# EAGLE schematic motor_driver (EAGLE 9.1.3)
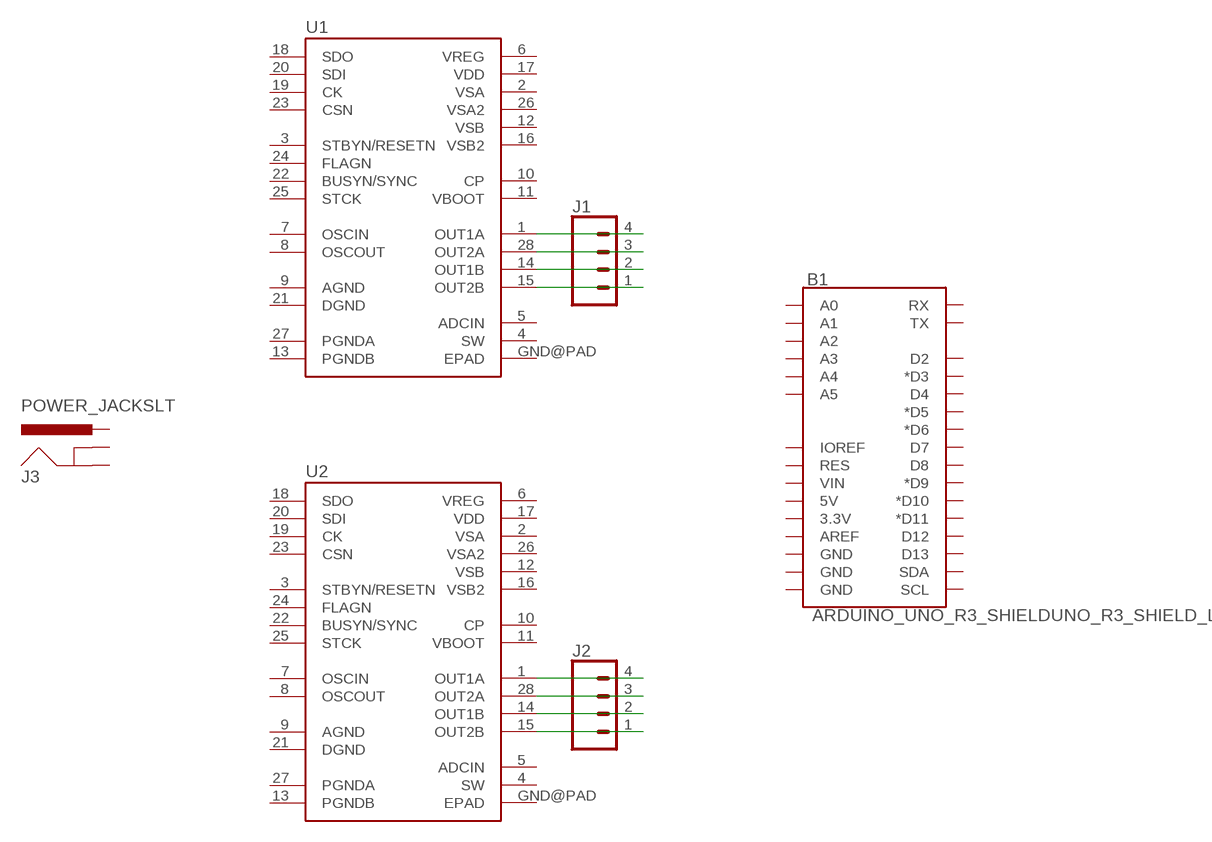
[diagram p0: schematic, sheet 1]

## Parts
B1  ARDUINO_UNO_R3_SHIELDUNO_R3_SHIELD_LOCK  [UNO_R3_SHIELD_LOCK]
J1  CONN_04SCREW  [SCREWTERMINAL-3.5MM-4]
J2  CONN_04SCREW  [SCREWTERMINAL-3.5MM-4]
J3  POWER_JACKSLT  [POWER_JACK_SLOT]
U1  L6470  [HTSSOP28]
U2  L6470  [HTSSOP28]

## Nets
N$1: J2.1 U2.15(OUT2B)
N$2: J2.2 U2.14(OUT1B)
N$3: J2.3 U2.28(OUT2A)
N$4: J2.4 U2.1(OUT1A)
N$5: J1.1 U1.15(OUT2B)
N$6: J1.2 U1.14(OUT1B)
N$7: J1.3 U1.28(OUT2A)
N$8: J1.4 U1.1(OUT1A)
Unconnected: B1.3.3V B1.5V B1.A0 B1.A1 B1.A2 B1.A3 B1.A4 B1.A5 B1.AREF B1.D2 B1.D3(*D3) B1.D4 B1.D5(*D5) B1.D6(*D6) B1.D7 B1.D8 B1.D9(*D9) B1.D10(*D10) B1.D11(*D11) B1.D12 B1.D13 B1.GND@0(GND) B1.GND@1(GND) B1.GND@2(GND) B1.IOREF B1.RES B1.RX B1.SCL B1.SDA B1.TX B1.VIN J3.GND@1(GNDBREAK) J3.GND@2(GND) J3.PWR U1.2(VSA) U1.3(STBYN/RESETN) U1.4(SW) U1.5(ADCIN) U1.6(VREG) U1.7(OSCIN) U1.8(OSCOUT) U1.9(AGND) U1.10(CP) U1.11(VBOOT) U1.12(VSB) U1.13(PGNDB) U1.16(VSB2) U1.17(VDD) U1.18(SDO) U1.19(CK) U1.20(SDI) U1.21(DGND) U1.22(BUSYN/SYNC) U1.23(CSN) U1.24(FLAGN) U1.25(STCK) U1.26(VSA2) U1.27(PGNDA) U1.GND@PAD(EPAD) U2.2(VSA) U2.3(STBYN/RESETN) U2.4(SW) U2.5(ADCIN) U2.6(VREG) U2.7(OSCIN) U2.8(OSCOUT) U2.9(AGND) U2.10(CP) U2.11(VBOOT) U2.12(VSB) U2.13(PGNDB) U2.16(VSB2) U2.17(VDD) U2.18(SDO) U2.19(CK) U2.20(SDI) U2.21(DGND) U2.22(BUSYN/SYNC) U2.23(CSN) U2.24(FLAGN) U2.25(STCK) U2.26(VSA2) U2.27(PGNDA) U2.GND@PAD(EPAD)

## Library data of the parts
B1 = SparkFun-Boards:ARDUINO_UNO_R3_SHIELD: Arduino R3 Shield Footprint Shield form compatible with the Arduino Uno R3. SparkFun Products: MG2639 Cellular Shield <https://www.sparkfun.com/products/13120> MIDI Shield <https://www.sparkfun.com/products/12898> R3 Stackable Headers Kit <https://www.sparkfun.com/products/11417>
J1 J2 = SparkFun-Connectors:CONN_04: Multi connection point. Often used as Generic Header-pin footprint for 0.1 inch spaced/style header connections On any of the 0.1 inch spaced packages, you can populate with these: Break Away Headers - Straight <https://www.sparkfun.com/products/116> (PRT-00116) Break Away Male Headers - Right Angle <https://www.sparkfun.com/products/553> (PRT-00553) Female Headers <https://www.sparkfun.com/products/115> (PRT-00115) Break Away Headers - Machine Pin <https://www.sparkfun.com/products/117> (PRT-00117) Break Away Female Headers - Swiss Machine Pin <https://www.sparkfun.com/products/743> (PRT-00743) For SCREWTERMINALS and SPRING TERMINALS visit here: Screw Terimnals on SparkFun.com <https://www.sparkfun.com/search/results?term=Screw+Terminals> (5mm/3.5mm/2.54mm spacing) This device is also useful as a general connection point to wire up your design to another part of your project. Our various solder wires solder well into these plated through hole pads. Hook-Up Wire - Assortment (Stranded, 22 AWG) <https://www.sparkfun.com/products/11375> (PRT-11375) Hook-Up Wire - Assortment (Solid Core, 22 AWG) <https://www.sparkfun.com/products/11367> (PRT-11367) View the entire wire category on our website here <https://www.sparkfun.com/categories/141> Special notes: Molex polarized connector foot print use with SKU : PRT-08231 with associated crimp pins and housings. 1MM SMD Version SKU: PRT-10208; PROD_ID: 2xCONN-08399; SF_ID: 2xPRT-08084
J3 = SparkFun-Connectors:POWER_JACK: Power Jack Connector This is the standard 5.5mm barrel jack for power. The PTH is the most common, proven, reliable, footprint. The Slot footprint only works if the mill layer is transmitted to the PCB fab house so be warned. Here are the connectors we sell at SparkFun: DC Barrel Power Jack/Connector <https://www.sparkfun.com/products/119> (PRT-00119) DC Barrel Power Jack/Connector (SMD) <https://www.sparkfun.com/products/12748> (PRT-12748) DC Barrel Jack Adapter - Breadboard Compatible <https://www.sparkfun.com/products/10811> (PRT-10811) It is used on this SparkFun product (and many, many others): SparkFun RedBoard - Programmed with Arduino <https://www.sparkfun.com/products/12757> (DEV-12757) Also, if you need a mating power supply or connector, please check these out: Wall Adapter Power Supply - 9VDC 650mA <https://www.sparkfun.com/products/298> (TOL-00298) DC Barrel Jack Adapter - Male <https://www.sparkfun.com/products/10287> (PRT-10287); PROD_ID: PRT-00119
U1 U2 = SparkFun-IC-Special-Function:L6470: 3A RMS/7A peak bipolar stepper motor driver with SPI control and step input in HTSSOP-28 package. IC-10648; PROD_ID: IC-10648